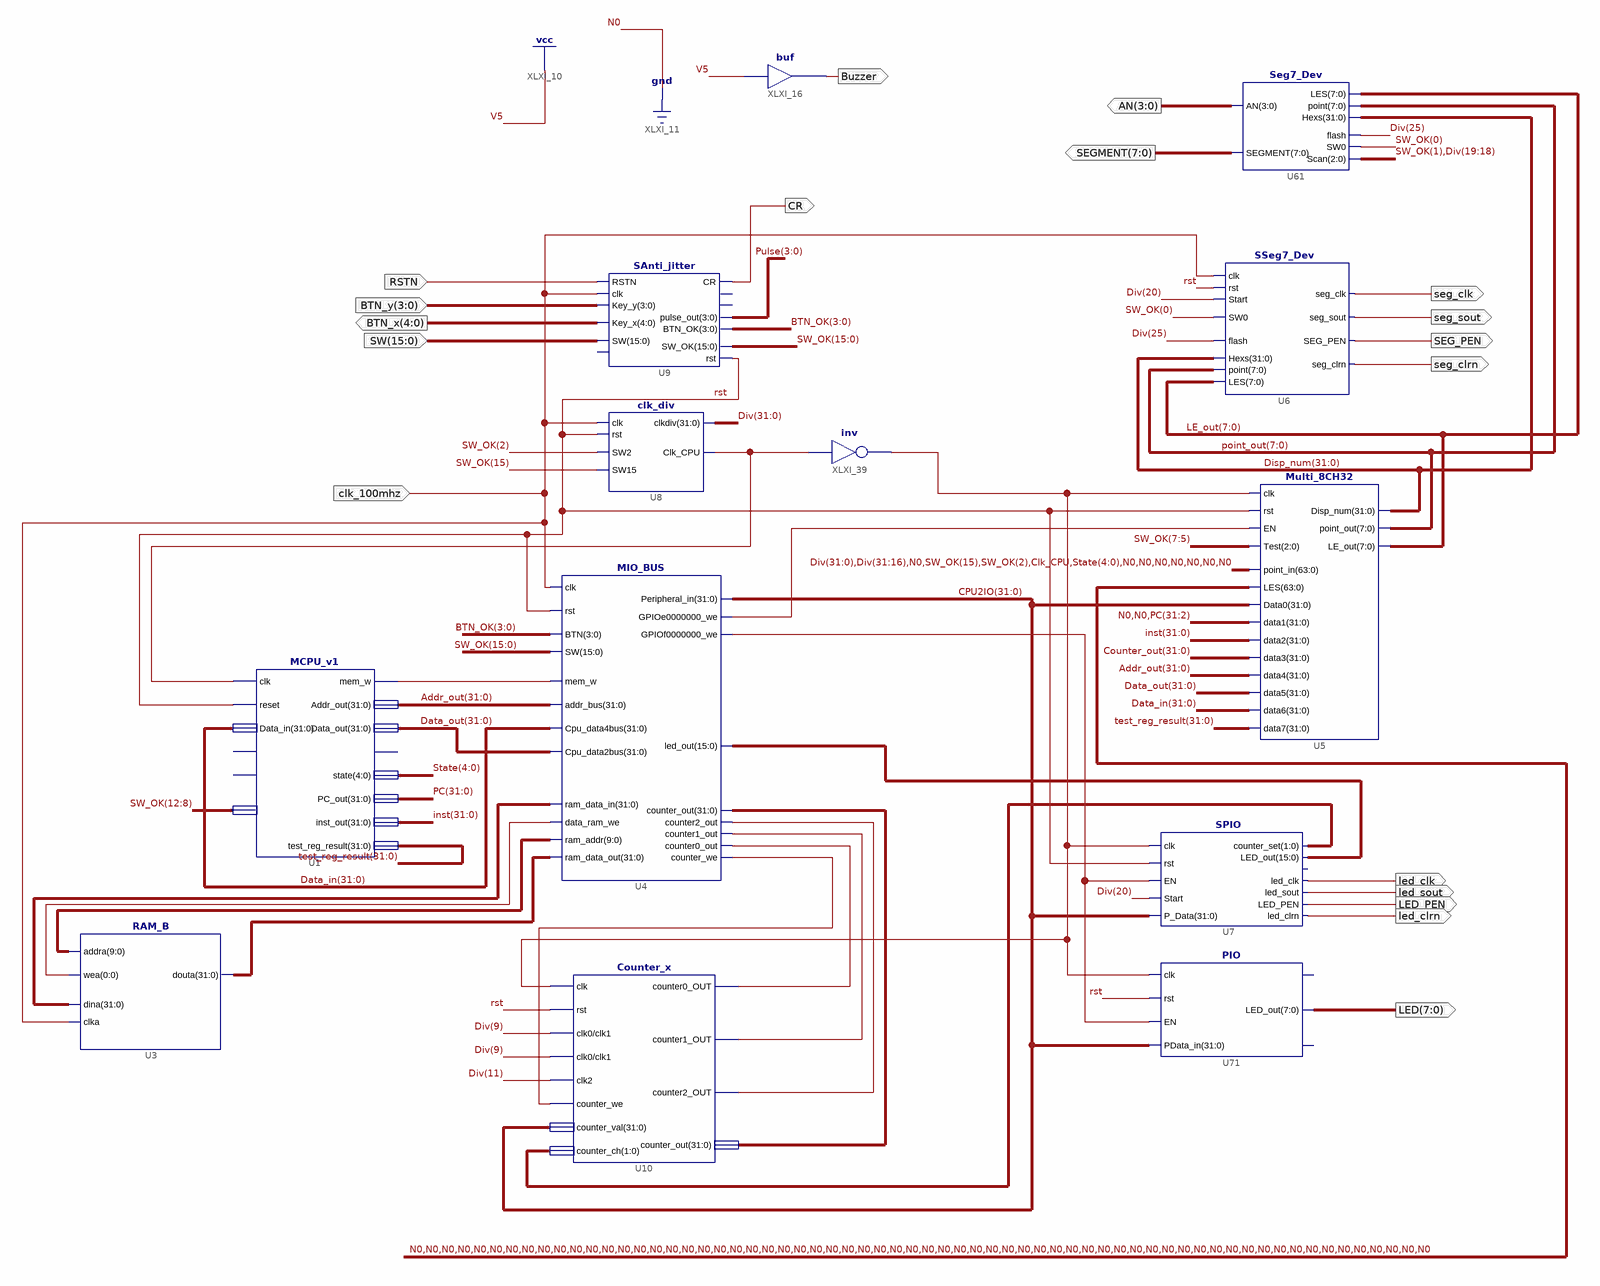
[diagram p0: schematic sheet 1]
// Xilinx ISE schematic OExp05_framework.sch (kintex7) as structural Verilog: 13 symbols, 18 ports
module OExp05_framework (
  input  RSTN,
  input  [3:0] BTN_y,
  input  [15:0] SW,
  input  clk_100mhz,
  output [4:0] BTN_x,
  output CR,
  output seg_clk,
  output seg_sout,
  output SEG_PEN,
  output seg_clrn,
  output led_clk,
  output led_sout,
  output LED_PEN,
  output led_clrn,
  output [7:0] LED,
  output Buzzer,
  output [7:0] SEGMENT,
  output [3:0] AN
);

  wire Clk_CPU, IO_clk, rst, XLXN_178, XLXN_179, XLXN_180, XLXN_182, XLXN_188, XLXN_189, XLXN_194;
  wire [0:0] XLXN_211;
  wire [1:0] XLXN_186;
  wire [3:0] BTN_OK, Pulse;
  wire [4:0] State;
  wire [7:0] LE_out, point_out;
  wire [9:0] XLXN_213;
  wire [15:0] SW_OK, XLXN_192;
  wire [31:0] Addr_out, Counter_out, CPU2IO, Data_in, Data_out, Disp_num, Div, inst, PC, test_reg_result,
       XLXN_177, XLXN_209, XLXN_215;

  SAnti_jitter U9 (
    .SW(SW), .Key_y(BTN_y), .Key_x(BTN_x), .RSTN(RSTN), .clk(clk_100mhz), .CR(CR), .rst(rst), .SW_OK(SW_OK),
    .pulse_out(Pulse), .BTN_OK(BTN_OK));  // open: readn, Key_out, Key_ready
  clk_div U8 (.clk(clk_100mhz), .rst(rst), .SW2(SW_OK[2]), .SW15(SW_OK[15]), .Clk_CPU(Clk_CPU), .clkdiv(Div));
  SSeg7_Dev U6 (
    .LES(LE_out), .SEG_PEN(SEG_PEN), .seg_sout(seg_sout), .seg_clrn(seg_clrn), .point(point_out),
    .Hexs(Disp_num), .SW0(SW_OK[0]), .flash(Div[25]), .seg_clk(seg_clk), .clk(clk_100mhz), .rst(rst),
    .Start(Div[20]));
  Seg7_Dev U61 (
    .LES(LE_out), .Scan({SW_OK[1], Div[19:18]}), .SEGMENT(SEGMENT), .AN(AN), .point(point_out),
    .flash(Div[25]), .SW0(SW_OK[0]), .Hexs(Disp_num));
  buf XLXI_16 (Buzzer, 1'b1);
  MIO_BUS U4 (
    .rst(rst), .clk(clk_100mhz), .mem_w(XLXN_194), .addr_bus(Addr_out), .Cpu_data4bus(Data_in),
    .Cpu_data2bus(Data_out), .ram_data_out(XLXN_215), .ram_addr(XLXN_213), .data_ram_we(XLXN_211[0]),
    .ram_data_in(XLXN_209), .counter_out(XLXN_177), .counter2_out(XLXN_178), .counter1_out(XLXN_179),
    .counter0_out(XLXN_180), .counter_we(XLXN_182), .BTN(BTN_OK), .SW(SW_OK), .led_out(XLXN_192),
    .Peripheral_in(CPU2IO), .GPIOe0000000_we(XLXN_188), .GPIOf0000000_we(XLXN_189));
  not XLXI_39 (IO_clk, Clk_CPU);
  Multi_8CH32 U5 (
    .Test(SW_OK[7:5]), .point_in({Div, Div[31:16], 1'b0, SW_OK[15], SW_OK[2], Clk_CPU, State, {7{1'b0}}}),
    .EN(XLXN_188), .clk(IO_clk), .rst(rst), .LES({64{1'b0}}), .Data0(CPU2IO), .data1({2'b00, PC[31:2]}),
    .data2(inst), .data3(Counter_out), .data4(Addr_out), .data5(Data_out), .data6(Data_in),
    .data7(test_reg_result), .point_out(point_out), .LE_out(LE_out), .Disp_num(Disp_num));
  SPIO U7 (
    .clk(IO_clk), .P_Data(CPU2IO), .rst(rst), .EN(XLXN_189), .Start(Div[20]), .led_clk(led_clk),
    .LED_out(XLXN_192), .counter_set(XLXN_186), .led_clrn(led_clrn), .LED_PEN(LED_PEN), .led_sout(led_sout));  // open: GPIOf0
  PIO U71 (.clk(IO_clk), .rst(rst), .EN(XLXN_189), .PData_in(CPU2IO), .LED_out(LED));  // open: GPIOf0, counter_set
  MCPU_v1 U1 (
    .clk(Clk_CPU), .reset(rst), .Data_in(Data_in), .mem_w(XLXN_194), .Addr_out(Addr_out),
    .Data_out(Data_out), .state(State), .PC_out(PC), .inst_out(inst), .test_reg_result(test_reg_result),
    .test_reg_index(SW_OK[12:8]));  // open: INT, MIO_ready, CPU_MIO
  RAM_B U3 (.addra(XLXN_213), .clka(clk_100mhz), .wea(XLXN_211[0]), .dina(XLXN_209), .douta(XLXN_215));
  Counter_x U10 (
    .clk(IO_clk), .rst(rst), .clk0(Div[9]), .clk1(Div[9]), .clk2(Div[11]), .counter_we(XLXN_182),
    .counter_val(CPU2IO), .counter_ch(XLXN_186), .counter0_OUT(XLXN_180), .counter1_OUT(XLXN_179),
    .counter2_OUT(XLXN_178), .counter_out(XLXN_177));
endmodule
